# EAGLE schematic Plakat (EAGLE 7.5.0)
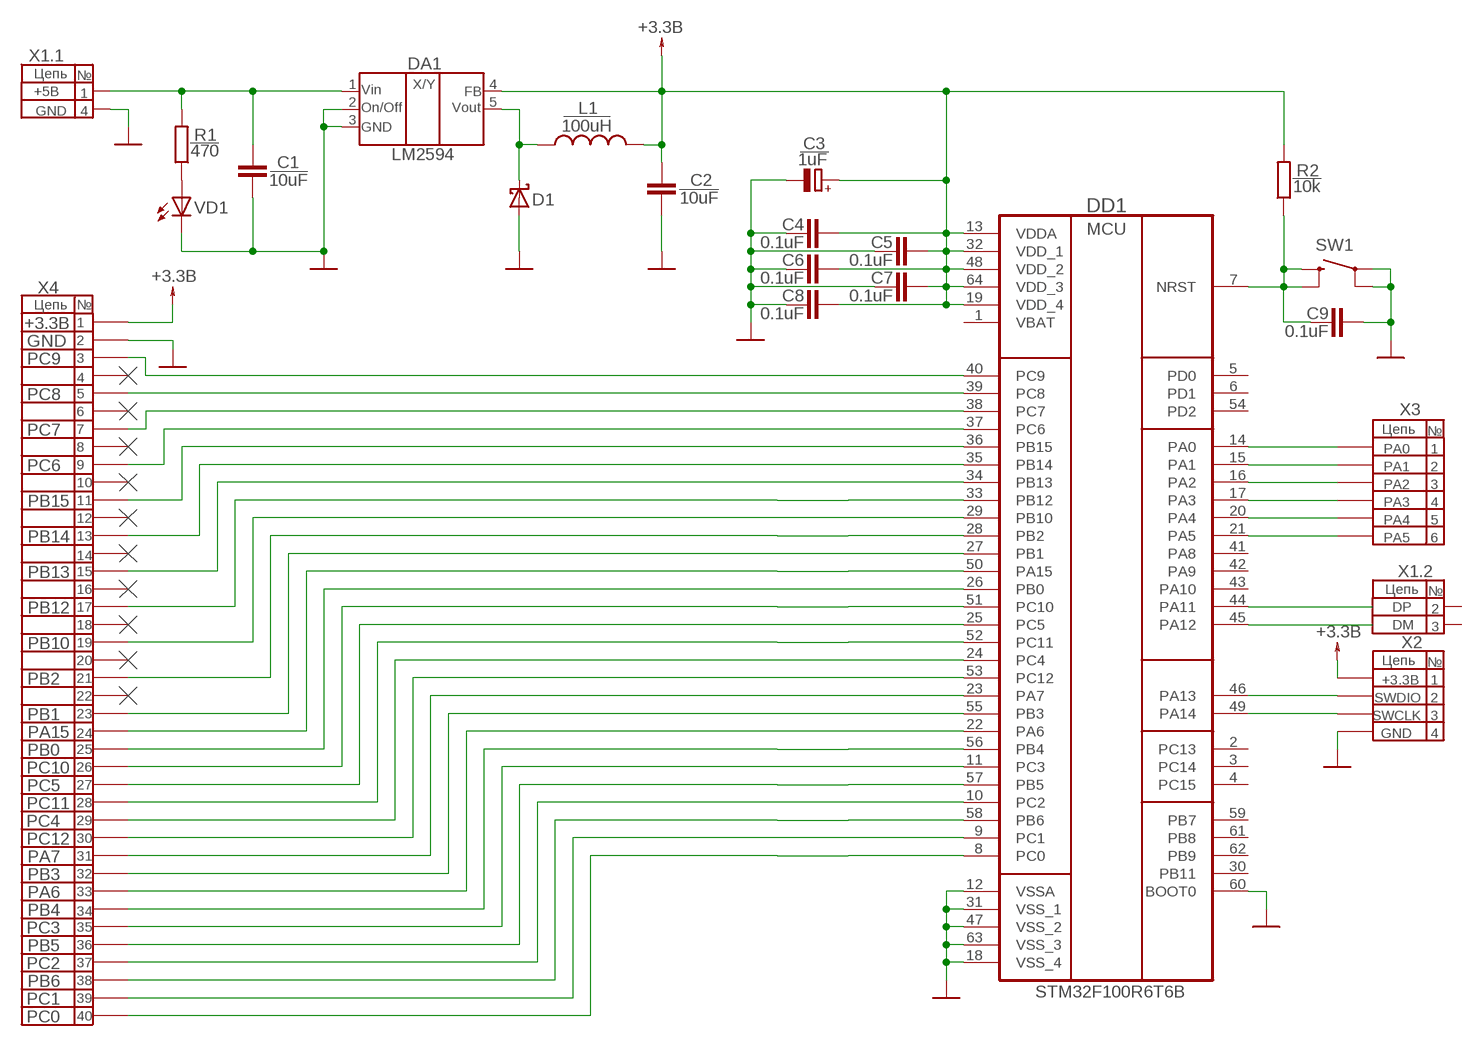
[diagram p0: schematic, sheet 1]

## Parts
C1  10uF  C-EUC0805  [C0805]
C2  10uF  C-EUC0805  [C0805]
C3  1uF  CPOL-EU  [TYPE_A_TECAP]
C4  0.1uF  C-EUC0805  [C0805]
C5  0.1uF  C-EUC0805  [C0805]
C6  0.1uF  C-EUC0805  [C0805]
C7  0.1uF  C-EUC0805  [C0805]
C8  0.1uF  C-EUC0805  [C0805]
C9  0.1uF  C-EUC0805  [C0805]
D1  1N5819-T  [DO41-7.6]
DA1  LM2594  [LM2495]
DD1  STM32F100R6T6B  [QFP50P1200X1200X160-64N]
L1  100uH  SRD0604-101KL  [101KL]
R1  470  R  [R0805]
R2  10k  R  [R0805]
SW1  DTSM-6  [DTSM-6]
VD1  LED_E  [LED_1206]
X1.1  PINHD-1X2  [1X02]
X1.2  PINHD-1X2  [1X02]
X2  PINHD-1X4  [1X04]
X3  PINHD-1X6  [1X06]
X4  PINHD-2X20  [2X20]

## Nets
GND: C1.2 C2.2 C3.- C4.1 C5.1 C6.1 C7.1 C8.1 C9.2 D1.A DA1.GND DA1.ON/OFF DD1.12(VSSA) DD1.18(VSS_4) DD1.31(VSS_1) DD1.47(VSS_2) DD1.60(BOOT0) DD1.63(VSS_3) SW1.1 SW1.2 VD1.C X1.1.2 X2.4 X4.2
N$1: C1.1 DA1.V(IN) R1.2 X1.1.1
N$2: D1.C DA1.OUT L1.2
N$3: DD1.14(PA0) X3.1
N$4: R1.1 VD1.A
N$6: DD1.15(PA1) X3.2
N$8: DD1.16(PA2) X3.3
N$9: DD1.17(PA3) X3.4
N$10: DD1.20(PA4) X3.5
N$11: DD1.21(PA5) X3.6
N$27: DD1.53(PC12) X4.30
N$30: C9.1 DD1.7(NRST) R2.1 SW1.3 SW1.4
N$39: DD1.40(PC9) X4.3
N$40: DD1.39(PC8) X4.5
N$41: DD1.38(PC7) X4.7
N$42: DD1.37(PC6) X4.9
N$43: DD1.36(PB15) X4.11
N$44: DD1.35(PB14) X4.13
N$45: DD1.34(PB13) X4.15
N$46: DD1.33(PB12) X4.17
N$47: DD1.29(PB10) X4.19
N$48: DD1.28(PB2) X4.21
N$49: DD1.27(PB1) X4.23
N$50: DD1.50(PA15) X4.24
N$51: DD1.26(PB0) X4.25
N$52: DD1.51(PC10) X4.26
N$53: DD1.25(PC5) X4.27
N$54: DD1.52(PC11) X4.28
N$55: DD1.24(PC4) X4.29
N$57: DD1.23(PA7) X4.31
N$58: DD1.55(PB3) X4.32
N$59: DD1.22(PA6) X4.33
N$60: DD1.56(PB4) X4.34
N$61: DD1.11(PC3) X4.35
N$62: DD1.57(PB5) X4.36
N$63: DD1.10(PC2) X4.37
N$64: DD1.58(PB6) X4.38
N$65: DD1.9(PC1) X4.39
N$66: DD1.8(PC0) X4.40
N$67: DD1.44(PA11)
N$70: DD1.45(PA12)
SWCLK: DD1.49(PA14) X2.3
SWDIO: DD1.46(PA13) X2.2
VCC: C2.1 C3.+ C4.2 C5.2 C6.2 C7.2 C8.2 DA1.FB DD1.13(VDDA) DD1.19(VDD_4) DD1.32(VDD_1) DD1.48(VDD_2) DD1.64(VDD_3) L1.1 R2.2 X2.1 X4.1 ; supply symbol labelled +3.3В
Unconnected: DD1.2(PC13) DD1.3(PC14) DD1.4(PC15) DD1.5(PD0) DD1.6(PD1) DD1.30(PB11) DD1.41(PA8) DD1.42(PA9) DD1.43(PA10) DD1.54(PD2) DD1.59(PB7) DD1.61(PB8) DD1.62(PB9) X1.2.1 X1.2.2 X4.4 X4.6 X4.8 X4.10 X4.12 X4.14 X4.16 X4.18 X4.20 X4.22

## Notes on the sheet
- Цепь | №
- 1 | 4
- +5В | 1 | Vin | FB
- 2 | 5
- GND | 4 | On/Off | Vout
- 3
- GND
- MCU
- +3.3В
- GND
- PC9
- PC8
- PC7 | Цепь | №
- PA0 | 1
- PC6 | PA1 | 2
- PA2 | 3
- PB15 | PA3 | 4
- PA4 | 5
- PB14 | PA5 | 6
- PB13
- Цепь | №
- PB12 | DP | 2
- DM | 3
- PB10
- Цепь | №
- PB2 | +3.3В | 1
- SWDIO | 2
- PB1 | SWCLK | 3
- PA15 | GND | 4
- PB0
- PC10
- PC5
- PC11
- PC4
- PC12
- PA7
- PB3
- PA6
- PB4
- PC3
- PB5
- PC2
- PB6
- STM32F100R6T6B
- PC1
- PC0

## Power pins joined to a net without a drawn wire
VBAT: DD1.1(VBAT)

## Library data of the parts
C1 C2 C4-C9 = rcl:C-EU: CAPACITOR, European symbol
C3 = rcl:CPOL-EU: POLARIZED CAPACITOR, European symbol
D1 = diode:1N581*: 1.0A SCHOTTKY BARRIER RECTIFIER Source: http://www.diodes.com/datasheets/ds23001.pdf
DA1 = LM2594:LM2594
DD1 = ST Microelctronics_By_element14_Batch_1:STM32F100R6T6B: ARM-based 32-bit MCU; MPN: STM32F100R6T6B; OC_FARNELL: 1838506; OC_NEWARK: 76R0991; PACKAGE: QFP-64; SUPPLIER: STMICROELECTRONICS
L1 = BOURNS:SRD0604-101KL
R1 R2 = eagle-ltspice:R: RESISTOR, European symbol; SPICEMODEL: NONE; SPICEPREFIX: R
SW1 = switch-tact:DTSM-6
VD1 = eagle-ltspice:LED_E: LED Source: http://www.osram.convergy.de Source: www.luxeon.com Source: www.kingbright.com; SPICEMODEL: NONE; SPICEPREFIX: D; SPICETYPE: diode
X1.1 X1.2 = pinhead:PINHD-1X2: PIN HEADER
X2 = pinhead:PINHD-1X4: PIN HEADER
X3 = pinhead:PINHD-1X6: PIN HEADER
X4 = pinhead:PINHD-2X20: PIN HEADER